# Altium schematic sheet MCU.SchDoc
size A
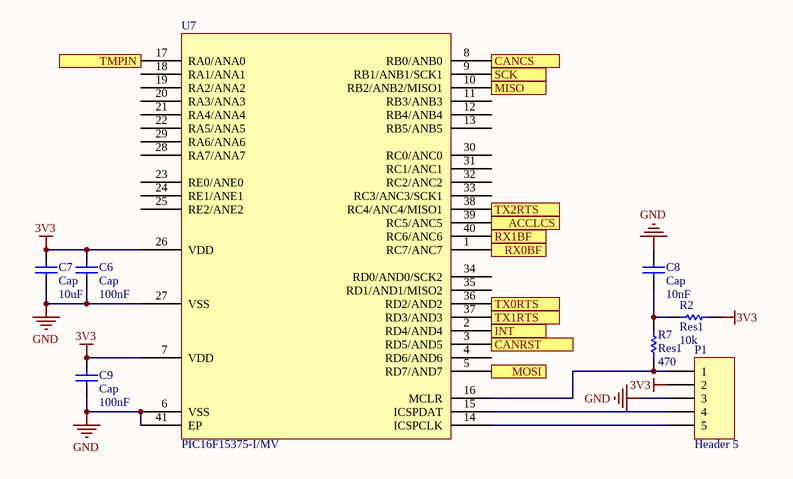
[diagram p0: MCU.SchDoc]

## Parts
C6  Cap  value 100nF  [1608[0603]]
C7  Cap  value 10uF  [6-0805_M]
C8  Cap  value 10nF  [1608[0603]]
C9  Cap  value 100nF  [1608[0603]]
P1  Header 5  [HDR1X5]
R2  Res1  value 10k  [0402-A]
R7  Res1  value 470  [0402-A]
U7  PIC16F15375-I/MV  [PIC16F15375-I/MV]

## Ports
ACCLCS (in), CANCS (out), CANRST (out), INT (in), MISO (in), MOSI (out), RX0BF (in), RX1BF (in), SCK (out), TMPIN (in), TX0RTS (out), TX1RTS (out), TX2RTS (out)

## Nets
3V3: C6.2 C7.2 C9.2 P1.2 R2.2 U7.7(VDD) U7.26(VDD)
GND: C6.1 C7.1 C8.1 C9.1 P1.3 U7.6(VSS) U7.27(VSS) U7.41(EP)
ACCLCS: U7.39(RC5/ANC5) ; port ACCLCS
CANCS: U7.8(RB0/ANB0) ; port CANCS
CANRST: U7.3(RD5/AND5) ; port CANRST
INT: U7.2(RD4/AND4) ; port INT
MISO: U7.10(RB2/ANB2/MISO1) ; port MISO
MOSI: U7.5(RD7/AND7) ; port MOSI
RX0BF: U7.1(RC7/ANC7) ; port RX0BF
RX1BF: U7.40(RC6/ANC6) ; port RX1BF
SCK: U7.9(RB1/ANB1/SCK1) ; port SCK
TMPIN: U7.17(RA0/ANA0) ; port TMPIN
TX0RTS: U7.36(RD2/AND2) ; port TX0RTS
TX1RTS: U7.37(RD3/AND3) ; port TX1RTS
TX2RTS: U7.38(RC4/ANC4/MISO1) ; port TX2RTS
NetC8_2: C8.2 R2.1 R7.2
NetP1_1: P1.1 R7.1 U7.16(MCLR)
NetP1_4: P1.4 U7.15(ICSPDAT)
NetP1_5: P1.5 U7.14(ICSPCLK)

Not connected (* = marked no-connect by the designer): U7 4(RD6/AND6) 11(RB3/ANB3) 12(RB4/ANB4) 13(RB5/ANB5) 18(RA1/ANA1) 19(RA2/ANA2) 20(RA3/ANA3) 21(RA4/ANA4) 22(RA5/ANA5) 23(RE0/ANE0) 24(RE1/ANE1) 25(RE2/ANE2) 28(RA7/ANA7) 29(RA6/ANA6) 30(RC0/ANC0) 31(RC1/ANC1) 32(RC2/ANC2) 33(RC3/ANC3/SCK1) 34(RD0/AND0/SCK2) 35(RD1/AND1/MISO2)

## Library data of the parts
C6-C9 = Cap: Capacitor; Published: 8-Jun-2000; LatestRevisionDate: 17-Jul-2002; LatestRevisionNote: Re-released for DXP Platform.; PackageReference: RAD-0.3; Publisher: Altium Limited; PackageDescription: Radial Cap, Thru-Hole; 2 Leads; 0.3 in Pin Spacing
P1 = Header 5: Header, 5-Pin; LatestRevisionDate: 17-Jul-2002; LatestRevisionNote: Re-released for DXP Platform.; Publisher: Altium Limited
R2 R7 = Res1: Resistor; Published: 8-Jun-2000; LatestRevisionDate: 17-Jul-2002; LatestRevisionNote: Re-released for DXP Platform.; PackageReference: AXIAL-0.3; Publisher: Altium Limited; PackageDescription: Axial Device, Thru-Hole; 2 Leads; 0.3 in Pin Spacing